# EAGLE design switch (EAGLE 8.7.0)
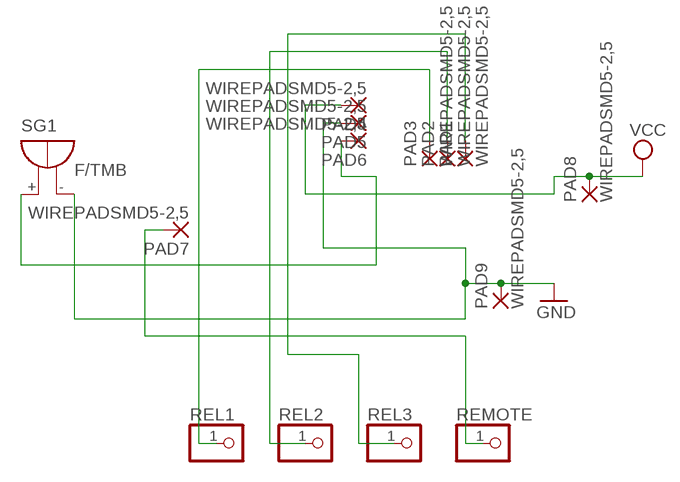
[diagram p0: schematic, sheet 1]

## Parts
PAD1  WIREPADSMD5-2,5  [5-2,5]
PAD2  WIREPADSMD5-2,5  [5-2,5]
PAD3  WIREPADSMD5-2,5  [5-2,5]
PAD4  WIREPADSMD5-2,5  [5-2,5]
PAD5  WIREPADSMD5-2,5  [5-2,5]
PAD6  WIREPADSMD5-2,5  [5-2,5]
PAD7  WIREPADSMD5-2,5  [5-2,5]
PAD8  WIREPADSMD5-2,5  [5-2,5]
PAD9  WIREPADSMD5-2,5  [5-2,5]
REL1  PINHD-1X1  [1X01]
REL2  PINHD-1X1  [1X01]
REL3  PINHD-1X1  [1X01]
REMOTE  PINHD-1X1  [1X01]
SG1  F/TMB  [F/TMB]

## Nets
GND: PAD5.1(P) PAD9.1(P) SG1.-
N$1: PAD3.1(P) REL1.1
N$2: PAD2.1(P) REL2.1
N$3: PAD1.1(P) REL3.1
N$7: PAD7.1(P) REMOTE.1
N$10: PAD6.1(P) SG1.+
VCC: PAD4.1(P) PAD8.1(P)

## Library data of the parts
PAD1-PAD9 = wirepad:WIREPAD: Wire PAD connect wire on PCB
REL1-REL3 REMOTE = pinhead:PINHD-1X1: PIN HEADER
SG1 = buzzer:F/TMB: BUZZER Source: Buerklin; OC_FARNELL: unknown; OC_NEWARK: unknown

## Board
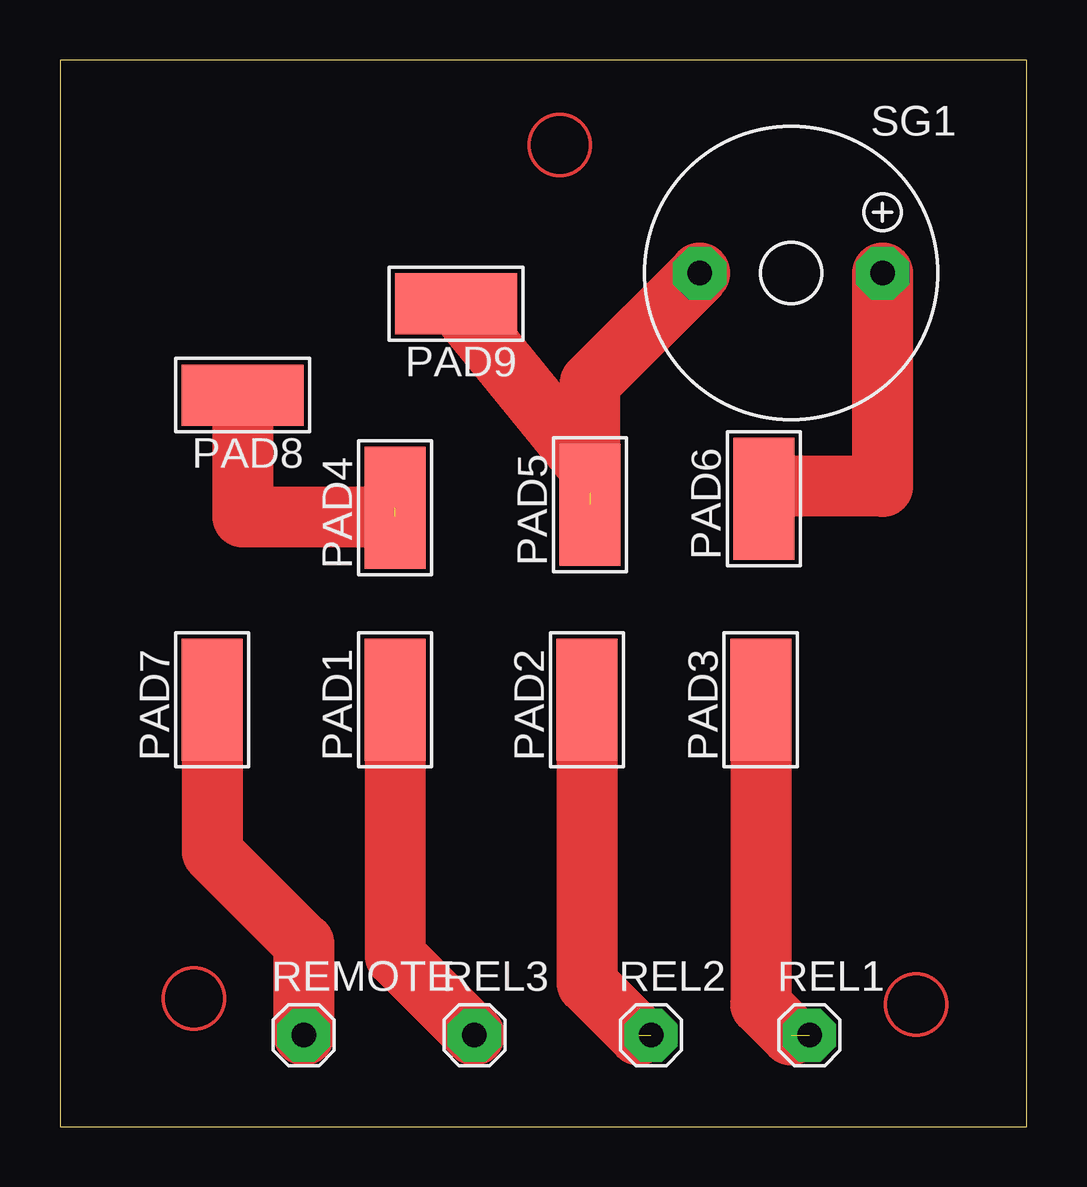
[diagram p1: board, top side]
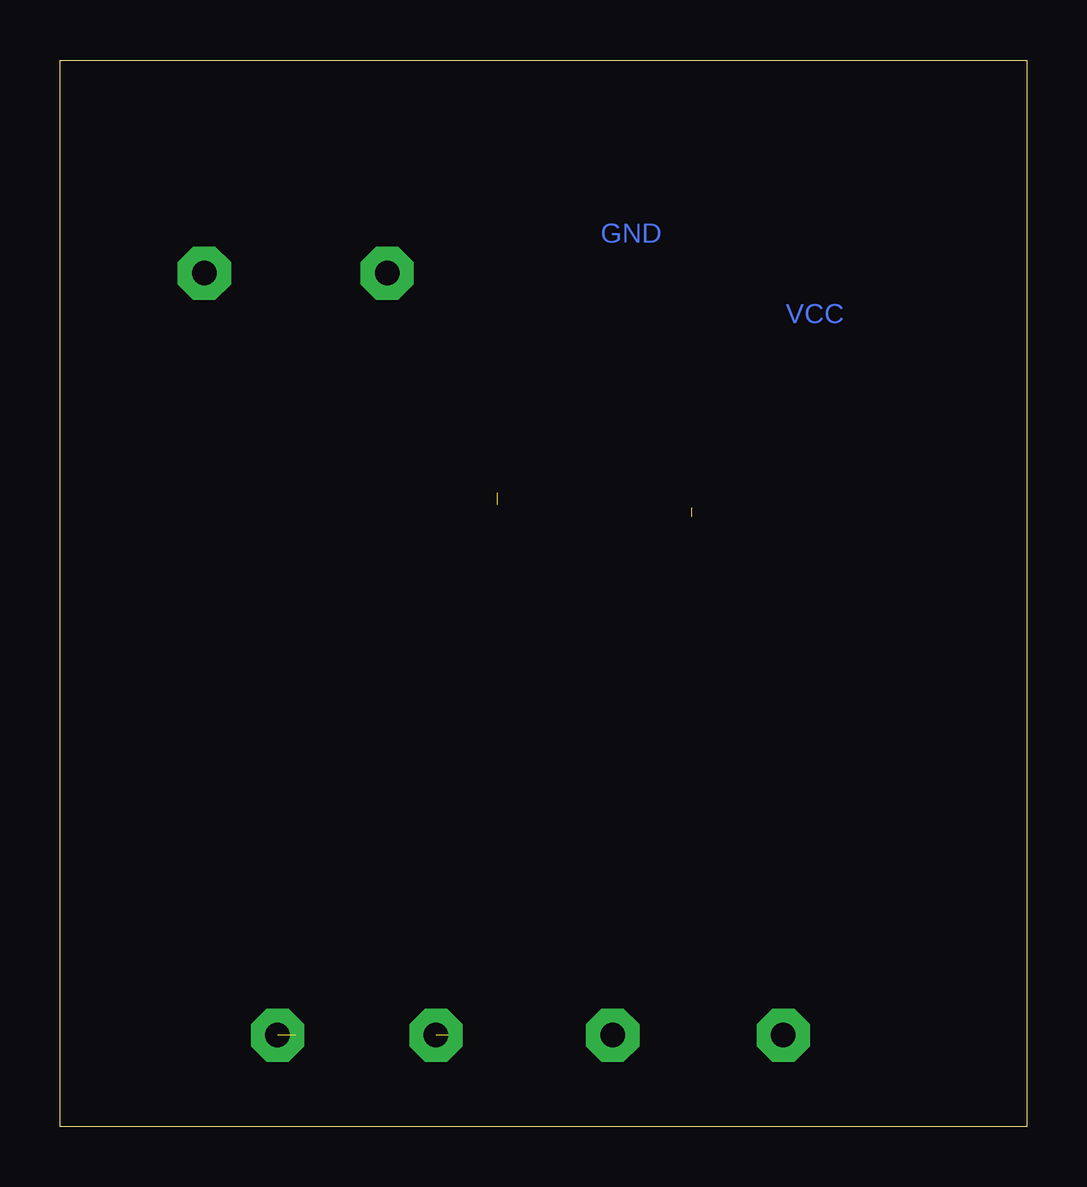
[diagram p2: board, bottom side, seen from below]

Size 40.31 x 44.44 mm. Coordinates in mm from the lower left corner, seen from the top.
Outline: 0,0 40.31,0 40.31,44.44 0,44.44 0,0
Copper layers (1*16): Top 0.035mm / dielectric 1.5mm / Bottom 0.035mm
Design rules "hobby": minimum track width 0.8mm, minimum drill 0.8mm, track to track 0.8mm, track to pad 0.8mm, pad to pad 0.45mm, via to via 0.8mm, smd to smd 8mil, copper to edge 10mil, drill to drill 8mil, minimum pad ring 0.6mm, minimum via ring 0.6mm, stop-mask expansion 0mil, vias tented up to drill 0mil, thermal gap 10mil

### Footprints (pad centres in the part's own frame; a part is rotated, then mirrored left to right if it is on the bottom)
5-2,5 = smd 2.54 x 5.08: 1 0,0
1X01 = drill 1.016 octagon: 1 0,0
F/TMB = drill 1.016 pad 2.159 octagon: + 3.81,0; - -3.81,0

### Placement (x,y rotation side)
PAD1  13.97,17.78 0 top
PAD2  21.97,17.78 0 top
PAD3  29.21,17.78 0 top
PAD4  13.97,25.78 0 top
PAD5  22.1,25.91 0 top
PAD6  29.34,26.16 0 top
PAD7  6.35,17.78 0 top
PAD8  7.62,30.48 90 top
PAD9  16.51,34.29 90 top
REL1  31.24,3.81 0 top
REL2  24.64,3.81 0 top
REL3  17.27,3.81 0 top
REMOTE  10.16,3.81 0 top
SG1  30.48,35.56 0 top

### Tracks (layer width: path | path; a pad name or v marks a point on that pad's centre or on a via)
GND  (1 unrouted)
  Top 2.54: SG1.- 22.1,30.99 22.1,27.43 | PAD9.1 22.1,27.43 | 22.1,27.43 22.1,26.42
N$1  (1 unrouted)
  Top 2.54: PAD3.1 29.21,5.08 30.48,3.81
N$2  (1 unrouted)
  Top 2.54: PAD2.1 21.97,5.97 24.13,3.81
N$3
  Top 2.54: PAD1.1 13.97,7.11 REL3.1
N$7
  Top 2.54: PAD7.1 6.35,11.43 10.16,7.62 REMOTE.1
N$10
  Top 2.54: SG1.+ 34.29,26.67 29.84,26.67 PAD6.1
VCC  (1 unrouted)
  Top 2.54: PAD8.1 7.62,25.4 13.97,25.4
(copper drawn outside any net)
  shapes: Top circle x3

### Text on the board
Bottom: GND | VCC